# Altium schematic sheet HEADER_BANK.SchDoc
size B; DocumentNumber: 12; SheetNumber: 12; SheetTotal: 13
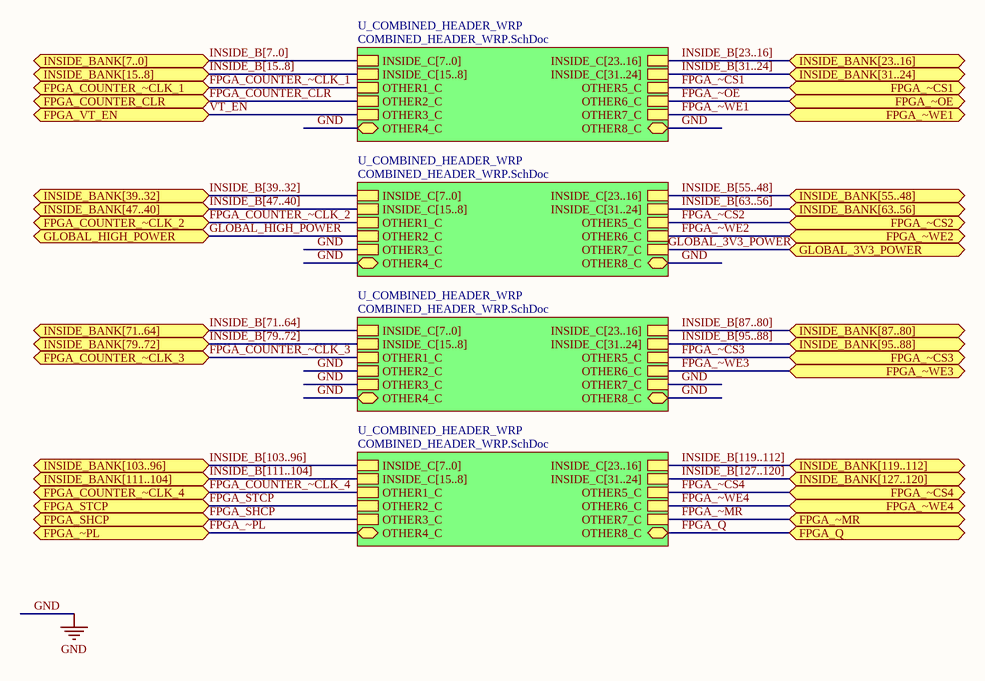
[diagram p0: HEADER_BANK.SchDoc]

## Sub-sheets
U_COMBINED_HEADER_WRP = COMBINED_HEADER_WRP.SchDoc: OTHER1_C, OTHER2_C, OTHER3_C, OTHER5_C, OTHER6_C, OTHER7_C, INSIDE_C[7..0], INSIDE_C[15..8], INSIDE_C[23..16], INSIDE_C[31..24], OTHER4_C, OTHER8_C
U_COMBINED_HEADER_WRP = COMBINED_HEADER_WRP.SchDoc: OTHER1_C, OTHER2_C, OTHER3_C, OTHER5_C, OTHER6_C, OTHER7_C, INSIDE_C[7..0], INSIDE_C[15..8], INSIDE_C[23..16], INSIDE_C[31..24], OTHER4_C, OTHER8_C
U_COMBINED_HEADER_WRP = COMBINED_HEADER_WRP.SchDoc: OTHER1_C, OTHER2_C, OTHER3_C, OTHER5_C, OTHER6_C, OTHER7_C, INSIDE_C[7..0], INSIDE_C[15..8], INSIDE_C[23..16], INSIDE_C[31..24], OTHER4_C, OTHER8_C
U_COMBINED_HEADER_WRP = COMBINED_HEADER_WRP.SchDoc: OTHER1_C, OTHER2_C, OTHER3_C, OTHER5_C, OTHER6_C, OTHER7_C, INSIDE_C[7..0], INSIDE_C[15..8], INSIDE_C[23..16], INSIDE_C[31..24], OTHER4_C, OTHER8_C

## Ports
FPGA_COUNTER_CLR, FPGA_COUNTER_~CLK_1, FPGA_COUNTER_~CLK_2, FPGA_COUNTER_~CLK_3, FPGA_COUNTER_~CLK_4, FPGA_Q, FPGA_SHCP, FPGA_STCP, FPGA_VT_EN, FPGA_~CS1, FPGA_~CS2, FPGA_~CS3, FPGA_~CS4, FPGA_~MR, FPGA_~OE, FPGA_~PL, FPGA_~WE1, FPGA_~WE2, FPGA_~WE3, FPGA_~WE4, GLOBAL_3V3_POWER, GLOBAL_HIGH_POWER, INSIDE_BANK[7..0], INSIDE_BANK[15..8], INSIDE_BANK[23..16], INSIDE_BANK[31..24], INSIDE_BANK[39..32], INSIDE_BANK[47..40], INSIDE_BANK[55..48], INSIDE_BANK[63..56], INSIDE_BANK[71..64], INSIDE_BANK[79..72], INSIDE_BANK[87..80], INSIDE_BANK[95..88], INSIDE_BANK[103..96], INSIDE_BANK[111..104], INSIDE_BANK[119..112], INSIDE_BANK[127..120]

## Nets
GND: sheet U_COMBINED_HEADER_WRP/OTHER4_C, sheet U_COMBINED_HEADER_WRP/OTHER8_C, sheet U_COMBINED_HEADER_WRP/OTHER3_C, sheet U_COMBINED_HEADER_WRP/OTHER4_C, sheet U_COMBINED_HEADER_WRP/OTHER8_C, sheet U_COMBINED_HEADER_WRP/OTHER2_C, sheet U_COMBINED_HEADER_WRP/OTHER3_C, sheet U_COMBINED_HEADER_WRP/OTHER7_C, sheet U_COMBINED_HEADER_WRP/OTHER4_C, sheet U_COMBINED_HEADER_WRP/OTHER8_C
FPGA_COUNTER_CLR: port FPGA_COUNTER_CLR, sheet U_COMBINED_HEADER_WRP/OTHER2_C
FPGA_COUNTER_~CLK_1: port FPGA_COUNTER_~CLK_1, sheet U_COMBINED_HEADER_WRP/OTHER1_C
FPGA_COUNTER_~CLK_2: port FPGA_COUNTER_~CLK_2, sheet U_COMBINED_HEADER_WRP/OTHER1_C
FPGA_COUNTER_~CLK_3: port FPGA_COUNTER_~CLK_3, sheet U_COMBINED_HEADER_WRP/OTHER1_C
FPGA_COUNTER_~CLK_4: port FPGA_COUNTER_~CLK_4, sheet U_COMBINED_HEADER_WRP/OTHER1_C
FPGA_Q: port FPGA_Q, sheet U_COMBINED_HEADER_WRP/OTHER8_C
FPGA_SHCP: port FPGA_SHCP, sheet U_COMBINED_HEADER_WRP/OTHER3_C
FPGA_STCP: port FPGA_STCP, sheet U_COMBINED_HEADER_WRP/OTHER2_C
FPGA_~CS1: port FPGA_~CS1, sheet U_COMBINED_HEADER_WRP/OTHER5_C
FPGA_~CS2: port FPGA_~CS2, sheet U_COMBINED_HEADER_WRP/OTHER5_C
FPGA_~CS3: port FPGA_~CS3, sheet U_COMBINED_HEADER_WRP/OTHER5_C
FPGA_~CS4: port FPGA_~CS4, sheet U_COMBINED_HEADER_WRP/OTHER5_C
FPGA_~MR: port FPGA_~MR, sheet U_COMBINED_HEADER_WRP/OTHER7_C
FPGA_~OE: port FPGA_~OE, sheet U_COMBINED_HEADER_WRP/OTHER6_C
FPGA_~PL: port FPGA_~PL, sheet U_COMBINED_HEADER_WRP/OTHER4_C
FPGA_~WE1: port FPGA_~WE1, sheet U_COMBINED_HEADER_WRP/OTHER7_C
FPGA_~WE2: port FPGA_~WE2, sheet U_COMBINED_HEADER_WRP/OTHER6_C
FPGA_~WE3: port FPGA_~WE3, sheet U_COMBINED_HEADER_WRP/OTHER6_C
FPGA_~WE4: port FPGA_~WE4, sheet U_COMBINED_HEADER_WRP/OTHER6_C
GLOBAL_3V3_POWER: port GLOBAL_3V3_POWER, sheet U_COMBINED_HEADER_WRP/OTHER7_C
GLOBAL_HIGH_POWER: port GLOBAL_HIGH_POWER, sheet U_COMBINED_HEADER_WRP/OTHER2_C
VT_EN: port FPGA_VT_EN, sheet U_COMBINED_HEADER_WRP/OTHER3_C

## Buses and harness runs
bus INSIDE_B[7..0] = port INSIDE_BANK[7..0] = sheet U_COMBINED_HEADER_WRP/INSIDE_C[7..0]
bus INSIDE_B[15..8] = port INSIDE_BANK[15..8] = sheet U_COMBINED_HEADER_WRP/INSIDE_C[15..8]
bus INSIDE_B[23..16] = port INSIDE_BANK[23..16] = sheet U_COMBINED_HEADER_WRP/INSIDE_C[23..16]
bus INSIDE_B[31..24] = port INSIDE_BANK[31..24] = sheet U_COMBINED_HEADER_WRP/INSIDE_C[31..24]
bus INSIDE_B[39..32] = port INSIDE_BANK[39..32] = sheet U_COMBINED_HEADER_WRP/INSIDE_C[7..0]
bus INSIDE_B[47..40] = port INSIDE_BANK[47..40] = sheet U_COMBINED_HEADER_WRP/INSIDE_C[15..8]
bus INSIDE_B[55..48] = port INSIDE_BANK[55..48] = sheet U_COMBINED_HEADER_WRP/INSIDE_C[23..16]
bus INSIDE_B[63..56] = port INSIDE_BANK[63..56] = sheet U_COMBINED_HEADER_WRP/INSIDE_C[31..24]
bus INSIDE_B[71..64] = port INSIDE_BANK[71..64] = sheet U_COMBINED_HEADER_WRP/INSIDE_C[7..0]
bus INSIDE_B[79..72] = port INSIDE_BANK[79..72] = sheet U_COMBINED_HEADER_WRP/INSIDE_C[15..8]
bus INSIDE_B[87..80] = port INSIDE_BANK[87..80] = sheet U_COMBINED_HEADER_WRP/INSIDE_C[23..16]
bus INSIDE_B[95..88] = port INSIDE_BANK[95..88] = sheet U_COMBINED_HEADER_WRP/INSIDE_C[31..24]
bus INSIDE_B[103..96] = port INSIDE_BANK[103..96] = sheet U_COMBINED_HEADER_WRP/INSIDE_C[7..0]
bus INSIDE_B[111..104] = port INSIDE_BANK[111..104] = sheet U_COMBINED_HEADER_WRP/INSIDE_C[15..8]
bus INSIDE_B[119..112] = port INSIDE_BANK[119..112] = sheet U_COMBINED_HEADER_WRP/INSIDE_C[23..16]
bus INSIDE_B[127..120] = port INSIDE_BANK[127..120] = sheet U_COMBINED_HEADER_WRP/INSIDE_C[31..24]